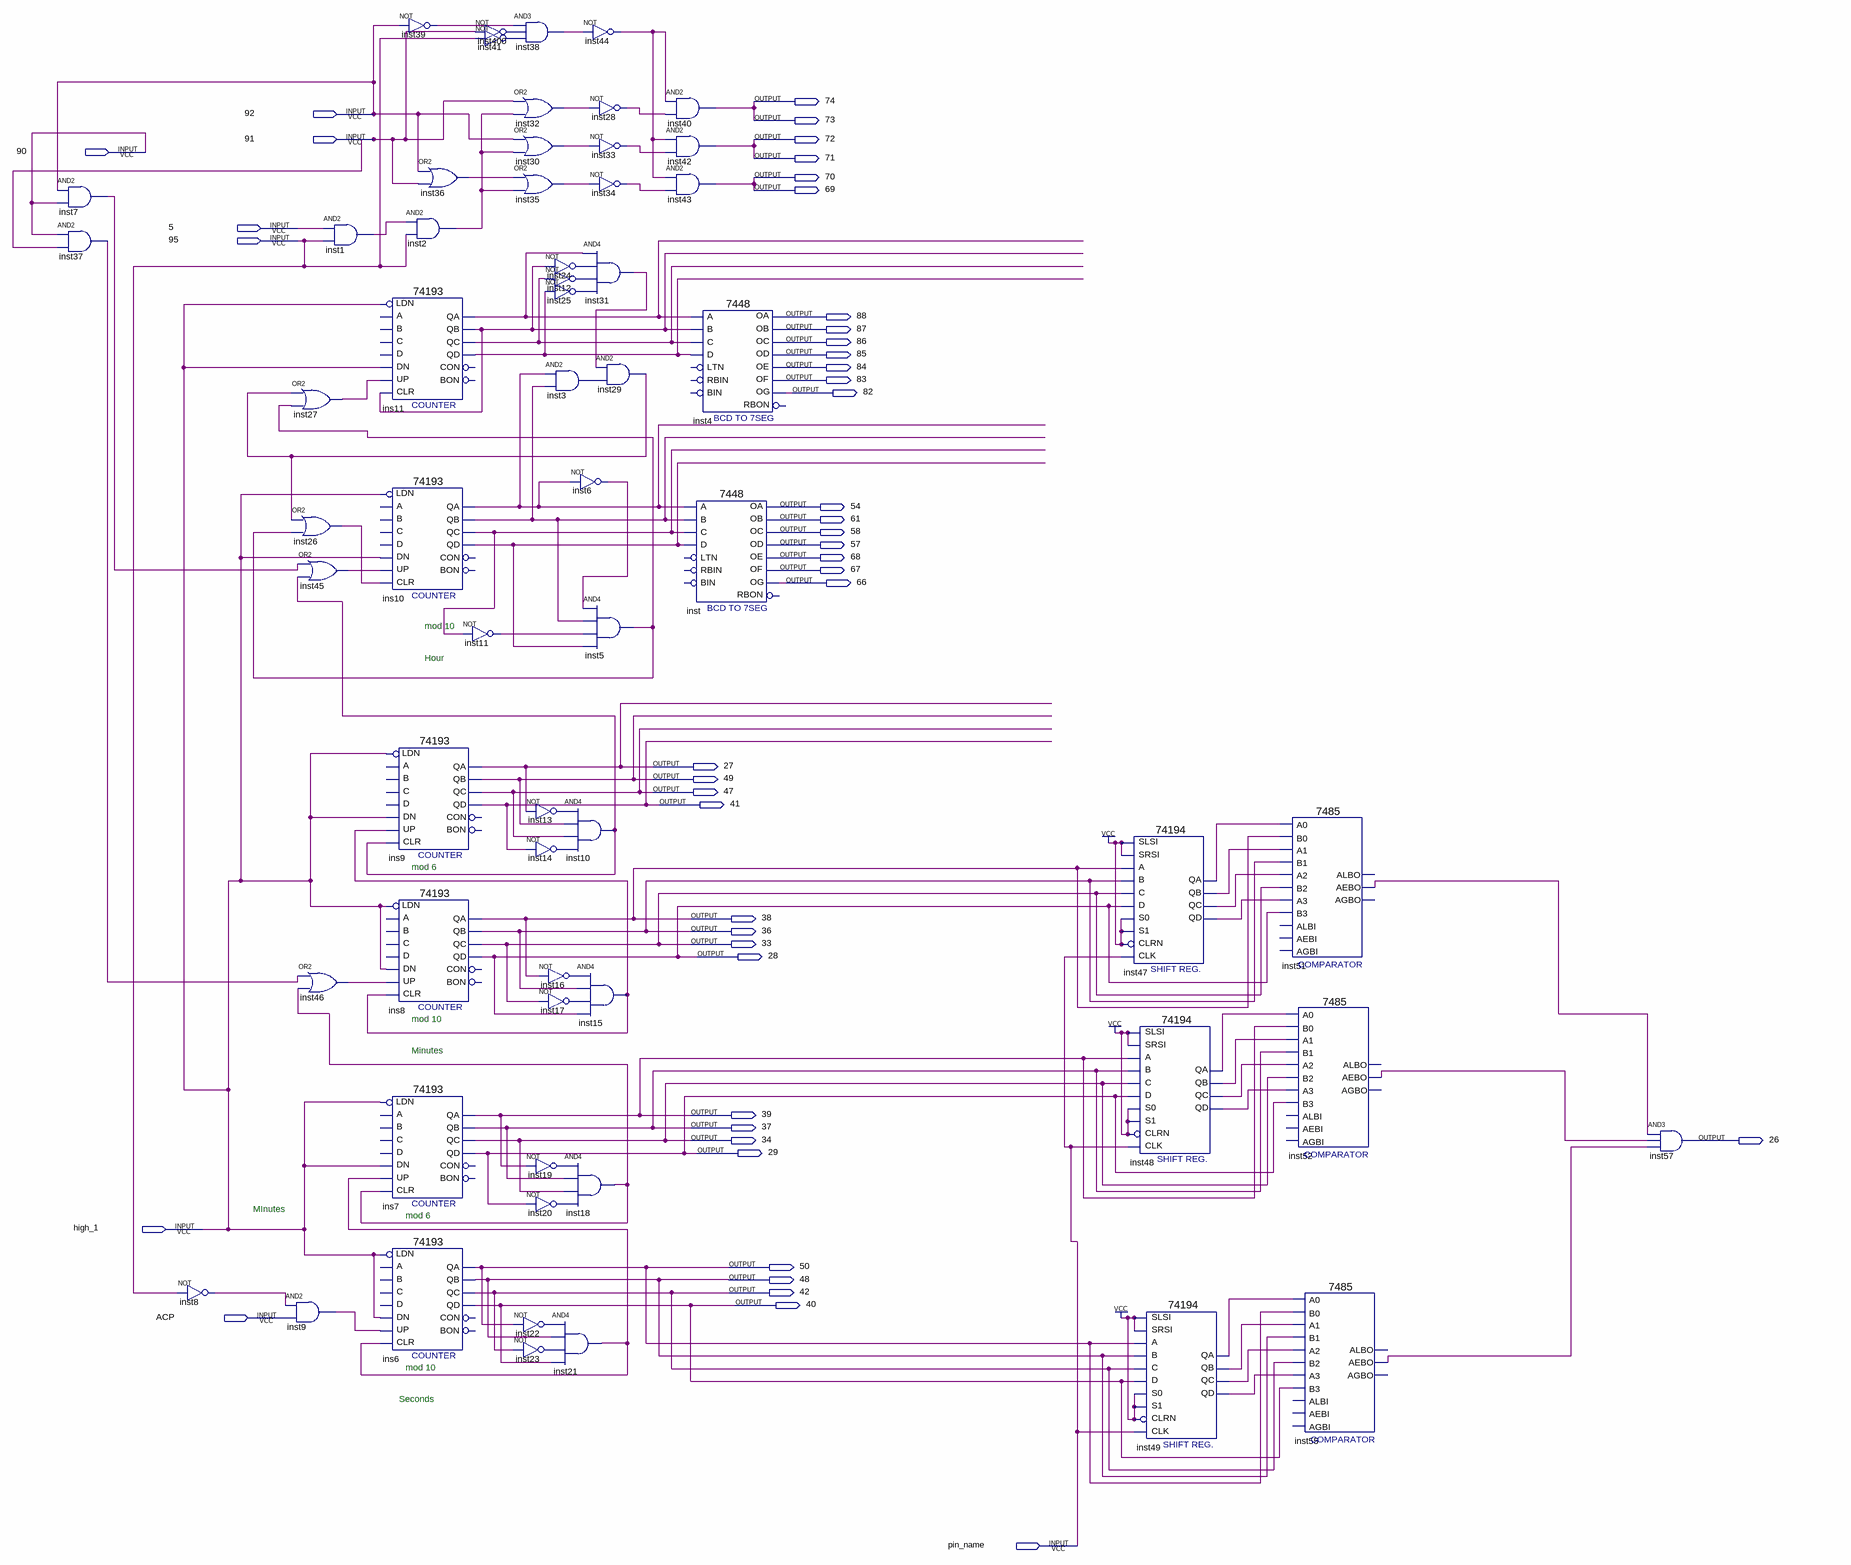
[diagram p0: schematic sheet]
// Quartus schematic clock.bdf as structural Verilog: 61 symbols, 45 pins
module clock (
  input  \92 ,
  input  \91 ,
  input  \90 ,
  input  \5 ,
  input  \95 ,
  input  high_1,
  input  ACP,
  input  pin_name,
  output \74 ,
  output \73 ,
  output \72 ,
  output \71 ,
  output \70 ,
  output \69 ,
  output \88 ,
  output \87 ,
  output \86 ,
  output \85 ,
  output \84 ,
  output \83 ,
  output \82 ,
  output \54 ,
  output \61 ,
  output \58 ,
  output \57 ,
  output \68 ,
  output \67 ,
  output \66 ,
  output \27 ,
  output \49 ,
  output \47 ,
  output \41 ,
  output \38 ,
  output \36 ,
  output \33 ,
  output \28 ,
  output \39 ,
  output \37 ,
  output \34 ,
  output \26 ,
  output \29 ,
  output \50 ,
  output \48 ,
  output \42 ,
  output \40 
);

  wire ins10_qa, ins10_qb, ins10_qc, ins10_qd, ins11_qa, ins11_qb, ins11_qc, ins11_qd, inst1_out, inst2_out,
       inst3_out, inst5_out, inst6_out, inst7_out, inst8_out, inst9_out, inst10_out, inst11_out, inst12_out,
       inst13_out, inst14_out, inst15_out, inst16_out, inst17_out, inst18_out, inst19_out, inst20_out,
       inst21_out, inst22_out, inst23_out, inst24_out, inst25_out, inst26_out, inst27_out, inst28_out,
       inst29_out, inst30_out, inst31_out, inst32_out, inst33_out, inst34_out, inst35_out, inst36_out,
       inst37_out, inst38_out, inst39_out, inst41_out, inst44_out, inst45_out, inst46_out, inst47_qa,
       inst47_qb, inst47_qc, inst47_qd, inst48_qa, inst48_qb, inst48_qc, inst48_qd, inst49_qa, inst49_qb,
       inst49_qc, inst49_qd, inst51_aebo, inst52_aebo, inst55_aebo, inst400_out;

  and inst7 (inst7_out, \92 , \90 );
  and inst37 (inst37_out, \90 , \91 );
  not inst8 (inst8_out, \95 );
  and inst1 (inst1_out, \5 , \95 );
  or inst27 (inst27_out, inst29_out, inst5_out);
  or inst26 (inst26_out, inst29_out, inst5_out);
  or inst45 (inst45_out, inst7_out, inst10_out);
  or inst46 (inst46_out, inst37_out, inst18_out);
  and inst9 (inst9_out, inst8_out, ACP);
  not inst39 (inst39_out, \92 );
  or inst36 (inst36_out, \92 , \91 );
  and inst2 (inst2_out, inst1_out, \95 );
  \74193  ins11 (
    .CLR(ins11_qb), .UP(inst27_out), .DN(high_1), .LDN(high_1), .QB(ins11_qb), .QA(ins11_qa), .QD(ins11_qd),
    .QC(ins11_qc));  // open: D, C, B, A, CON, BON
  \74193  ins10 (
    .CLR(inst26_out), .UP(inst45_out), .DN(high_1), .LDN(high_1), .QB(ins10_qb), .QA(ins10_qa),
    .QD(ins10_qd), .QC(ins10_qc));  // open: D, C, B, A, CON, BON
  \74193  ins9 (
    .CLR(inst10_out), .UP(inst15_out), .DN(high_1), .LDN(high_1), .QB(\49 ), .QA(\27 ), .QD(\41 ), .QC(\47 ));  // open: D, C, B, A, CON, BON
  \74193  ins8 (
    .CLR(inst15_out), .UP(inst46_out), .DN(high_1), .LDN(high_1), .QB(\36 ), .QA(\38 ), .QD(\28 ), .QC(\33 ));  // open: D, C, B, A, CON, BON
  \74193  ins7 (
    .CLR(inst18_out), .UP(inst21_out), .DN(high_1), .LDN(high_1), .QB(\37 ), .QA(\39 ), .QD(\29 ), .QC(\34 ));  // open: D, C, B, A, CON, BON
  \74193  ins6 (
    .CLR(inst21_out), .UP(inst9_out), .DN(high_1), .LDN(high_1), .QB(\48 ), .QA(\50 ), .QD(\40 ), .QC(\42 ));  // open: D, C, B, A, CON, BON
  not inst400 (inst400_out, \91 );
  not inst41 (inst41_out, \95 );
  not inst11 (inst11_out, ins10_qc);
  and inst38 (inst38_out, inst39_out, inst400_out, inst41_out);
  or inst32 (inst32_out, \91 , inst2_out);
  or inst30 (inst30_out, \92 , inst2_out);
  or inst35 (inst35_out, inst36_out, inst2_out);
  not inst13 (inst13_out, \27 );
  not inst14 (inst14_out, \41 );
  not inst19 (inst19_out, \39 );
  not inst20 (inst20_out, \29 );
  not inst22 (inst22_out, \50 );
  not inst23 (inst23_out, \42 );
  not inst24 (inst24_out, ins11_qb);
  not inst12 (inst12_out, ins11_qc);
  not inst25 (inst25_out, ins11_qd);
  and inst3 (inst3_out, ins10_qa, ins10_qb);
  not inst6 (inst6_out, ins10_qa);
  and inst10 (inst10_out, inst13_out, \49 , \47 , inst14_out);
  and inst15 (inst15_out, inst16_out, \36 , inst17_out, \28 );
  not inst16 (inst16_out, \38 );
  not inst17 (inst17_out, \33 );
  and inst18 (inst18_out, inst19_out, \37 , \34 , inst20_out);
  and inst21 (inst21_out, inst22_out, \48 , inst23_out, \40 );
  not inst44 (inst44_out, inst38_out);
  not inst28 (inst28_out, inst32_out);
  not inst33 (inst33_out, inst30_out);
  not inst34 (inst34_out, inst35_out);
  and inst31 (inst31_out, ins11_qa, inst24_out, inst12_out, inst25_out);
  and inst29 (inst29_out, inst31_out, inst3_out);
  and inst5 (inst5_out, inst6_out, ins10_qb, inst11_out, ins10_qd);
  and inst40 (\73 , inst44_out, inst28_out);
  and inst42 (\71 , inst44_out, inst33_out);
  and inst43 (\69 , inst44_out, inst34_out);
  \7448  inst4 (
    .A(ins11_qa), .C(ins11_qc), .D(ins11_qd), .B(ins11_qb), .OC(\86 ), .OE(\84 ), .OD(\85 ), .OF(\83 ),
    .OG(\82 ), .OB(\87 ), .OA(\88 ));  // open: RBIN, BIN, LTN, RBON
  \7448  inst (
    .A(ins10_qa), .C(ins10_qc), .D(ins10_qd), .B(ins10_qb), .OC(\58 ), .OE(\68 ), .OD(\57 ), .OF(\67 ),
    .OG(\66 ), .OB(\61 ), .OA(\54 ));  // open: RBIN, BIN, LTN, RBON
  \74194  inst47 (
    .SLSI(1'b1), .SRSI(1'b1), .B(\36 ), .C(\33 ), .CLK(pin_name), .CLRN(1'b1), .D(\28 ), .S1(1'b1),
    .S0(1'b1), .A(\38 ), .QA(inst47_qa), .QB(inst47_qb), .QC(inst47_qc), .QD(inst47_qd));
  \74194  inst48 (
    .SLSI(1'b1), .SRSI(1'b1), .B(\37 ), .C(\34 ), .CLK(pin_name), .CLRN(1'b1), .D(\29 ), .S1(1'b1),
    .S0(1'b1), .A(\39 ), .QA(inst48_qa), .QB(inst48_qb), .QC(inst48_qc), .QD(inst48_qd));
  \74194  inst49 (
    .SLSI(1'b1), .SRSI(1'b1), .B(\48 ), .C(\42 ), .CLK(pin_name), .CLRN(1'b1), .D(\40 ), .S1(1'b1),
    .S0(1'b1), .A(\50 ), .QA(inst49_qa), .QB(inst49_qb), .QC(inst49_qc), .QD(inst49_qd));
  \7485  inst51 (
    .A3(inst47_qd), .B2(\33 ), .A2(inst47_qc), .A0(inst47_qa), .B0(\38 ), .B3(\28 ), .A1(inst47_qb),
    .B1(\36 ), .AEBO(inst51_aebo));  // open: AEBI, AGBI, ALBI, ALBO, AGBO
  \7485  inst52 (
    .A3(inst48_qd), .B2(\34 ), .A2(inst48_qc), .A0(inst48_qa), .B0(\39 ), .B3(\29 ), .A1(inst48_qb),
    .B1(\37 ), .AEBO(inst52_aebo));  // open: AEBI, AGBI, ALBI, ALBO, AGBO
  \7485  inst55 (
    .A3(inst49_qd), .B2(\42 ), .A2(inst49_qc), .A0(inst49_qa), .B0(\50 ), .B3(\40 ), .A1(inst49_qb),
    .B1(\48 ), .AEBO(inst55_aebo));  // open: AEBI, AGBI, ALBI, ALBO, AGBO
  and inst57 (\26 , inst51_aebo, inst52_aebo, inst55_aebo);

  assign \70  = \69 ;
  assign \72  = \71 ;
  assign \74  = \73 ;

  // Notes on the sheet:
  //   mod 10
  //   Hour
  //   mod 6
  //   mod 10
  //   Minutes
  //   MInutes
  //   mod 6
  //   mod 10
  //   Seconds
endmodule
